# EAGLE design assistant (EAGLE 9.6.2)
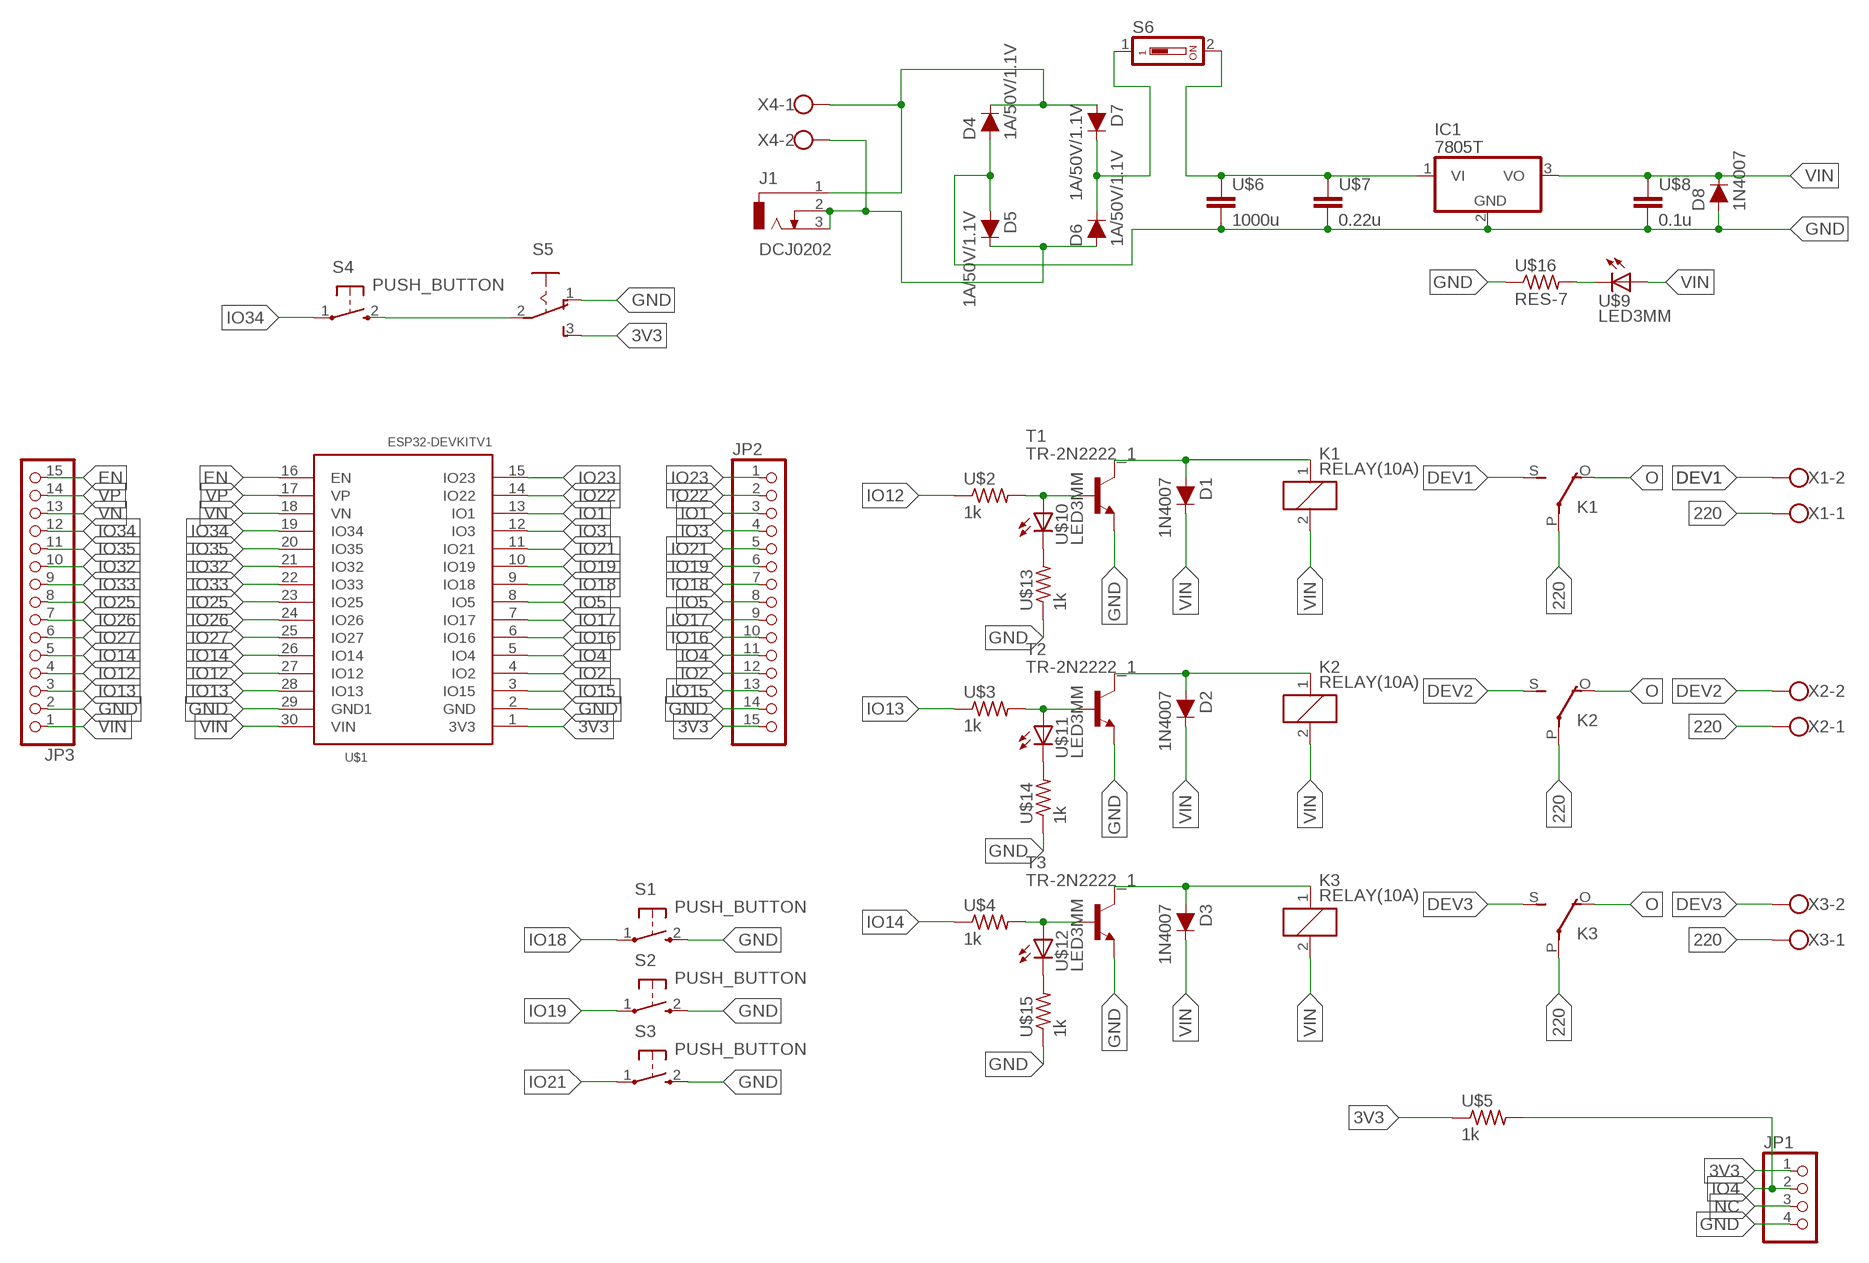
[diagram p0: schematic, sheet 1]

## Parts
D1  1N4007  DIODE(1A)-PTH  [DIODE-1N4001]
D2  1N4007  DIODE(1A)-PTH  [DIODE-1N4001]
D3  1N4007  DIODE(1A)-PTH  [DIODE-1N4001]
D4  1A/50V/1.1V  DIODE(1A)-PTH  [DIODE-1N4001]
D5  1A/50V/1.1V  DIODE(1A)-PTH  [DIODE-1N4001]
D6  1A/50V/1.1V  DIODE(1A)-PTH  [DIODE-1N4001]
D7  1A/50V/1.1V  DIODE(1A)-PTH  [DIODE-1N4001]
D8  1N4007  DIODE(1A)-PTH  [DIODE-1N4001]
IC1  7805T  [TO220H]
J1  DCJ0202  [DCJ0202]
JP1  PINHD-1X4  [1X04]
JP2  PINHD-1X15  [1X15]
JP3  PINHD-1X15  [1X15]
K1  RELAY(10A)  [G5LE]
K2  RELAY(10A)  [G5LE]
K3  RELAY(10A)  [G5LE]
S1  PUSH_BUTTON  [B3F-10XX]
S2  PUSH_BUTTON  [B3F-10XX]
S3  PUSH_BUTTON  [B3F-10XX]
S4  PUSH_BUTTON  [B3F-10XX]
S5  SLIDING_SWITCH  [255SB]
S6  DS01  [DS-01]
T1  TR-2N2222_1  [TO92-EBC]
T2  TR-2N2222_1  [TO92-EBC]
T3  TR-2N2222_1  [TO92-EBC]
U$1  ESP32DEVKITV1  [ESP32-DEVKITV1]
U$2  1k  RES-7  [0204/7]
U$3  1k  RES-7  [0204/7]
U$4  1k  RES-7  [0204/7]
U$5  1k  RES-7  [0204/7]
U$6  1000u  CAPACITOR  [C025-025X050]
U$7  0.22u  CAPACITOR  [C025-025X050]
U$8  0.1u  CAPACITOR  [C025-025X050]
U$9  LED3MM  [LED3MM]
U$10  LED3MM  [LED3MM]
U$11  LED3MM  [LED3MM]
U$12  LED3MM  [LED3MM]
U$13  1k  RES-7  [0204/7]
U$14  1k  RES-7  [0204/7]
U$15  1k  RES-7  [0204/7]
U$16  RES-7  [0204/7]
X1  ROSTA.POWER  [W239-302]
X2  ROSTA.POWER  [W239-302]
X3  ROSTA.POWER  [W239-302]
X4  ROSTA.POWER  [W239-302]

## Nets
3V3: JP1.1 JP2.15 S5.3(S) U$1.1(3V3) U$5.1
220: K1.P(2:P) K2.P(2:P) K3.P(2:P) X1.1 X2.1 X3.1
DEV1: K1.S(2:S) X1.2
DEV2: K2.S(2:S) X2.2
DEV3: K3.S(2:S) X3.2
EN: JP3.15 U$1.16(EN)
GND: D4.A D5.A D8.A IC1.2(GND) JP1.4 JP2.14 JP3.2 S1.2(S) S2.2(S) S3.2(S) S5.1(O) T1.E T2.E T3.E U$1.2(GND) U$1.29(GND1) U$6.2 U$7.2 U$8.2 U$13.1 U$14.1 U$15.1 U$16.1
IO1: JP2.3 U$1.13(IO1)
IO2: JP2.12 U$1.4(IO2)
IO3: JP2.4 U$1.12(IO3)
IO4: JP1.2 JP2.11 U$1.5(IO4) U$5.2
IO5: JP2.8 U$1.8(IO5)
IO12: JP3.4 U$1.27(IO12) U$2.1
IO13: JP3.3 U$1.28(IO13) U$3.1
IO14: JP3.5 U$1.26(IO14) U$4.1
IO15: JP2.13 U$1.3(IO15)
IO16: JP2.10 U$1.6(IO16)
IO17: JP2.9 U$1.7(IO17)
IO18: JP2.7 S1.1(P) U$1.9(IO18)
IO19: JP2.6 S2.1(P) U$1.10(IO19)
IO21: JP2.5 S3.1(P) U$1.11(IO21)
IO22: JP2.2 U$1.14(IO22)
IO23: JP2.1 U$1.15(IO23)
IO25: JP3.8 U$1.23(IO25)
IO26: JP3.7 U$1.24(IO26)
IO27: JP3.6 U$1.25(IO27)
IO32: JP3.10 U$1.21(IO32)
IO33: JP3.9 U$1.22(IO33)
IO34: JP3.12 S4.1(P) U$1.19(IO34)
IO35: JP3.11 U$1.20(IO35)
N$1: T1.B U$2.2 U$10.A
N$2: D1.A K1.1 T1.C
N$3: T2.B U$3.2 U$11.A
N$4: D2.A K2.1 T2.C
N$5: T3.B U$4.2 U$12.A
N$6: D3.A K3.1 T3.C
N$7: D5.C D6.A J1.2 J1.3 X4.2
N$8: S4.2(S) S5.2(P)
N$9: D4.C D7.A J1.1 X4.1
N$11: U$10.K(C) U$13.2
N$12: U$11.K(C) U$14.2
N$13: IC1.1(VI) S6.2 U$6.1 U$7.1
N$14: U$12.K(C) U$15.2
N$15: U$9.K(C) U$16.2
N$16: D6.C D7.C S6.1
NC: JP1.3
O: K1.O(2:O) K2.O(2:O) K3.O(2:O)
VIN: D1.C D2.C D3.C D8.C IC1.3(VO) JP3.1 K1.2 K2.2 K3.2 U$1.30(VIN) U$8.1 U$9.A
VN: JP3.13 U$1.18(VN)
VP: JP3.14 U$1.17(VP)

## Library data of the parts
D1-D3 D8 = MIA_LIBRARY-2-2-2:DIODE(1A): Diode These are standard reverse protection diodes and small signal diodes. SparkFun Products: SparkFun SparkPunk Sound Kit <https://www.sparkfun.com/products/11177> SparkFun ESP8266 Thing <https://www.sparkfun.com/products/13231>; PROD_ID: DIO-09176; VALUE: 1A/50V/1.1V
D4-D7 = MIA_LIBRARY-2-2-2:DIODE(1A): Diode These are standard reverse protection diodes and small signal diodes. SparkFun Products: SparkFun SparkPunk Sound Kit <https://www.sparkfun.com/products/11177> SparkFun ESP8266 Thing <https://www.sparkfun.com/products/13231>; PROD_ID: DIO-09176
IC1 = adafruit:78*: Positive VOLTAGE REGULATOR Added bigger pads to the TO-92 package
J1 = con-jack:DCJ0202: DC POWER JACK Source: DCJ0202.pdf; OC_FARNELL: unknown; OC_NEWARK: unknown
JP1 = MIA_LIBRARY-2-2-2:PINHD-1X4: PIN HEADER
JP2 JP3 = MIA_LIBRARY-2-2-2:PINHD-1X15: PIN HEADER
K1-K3 = MIA_LIBRARY-2-2-2:RELAY(10A): RELAY 1 x switch, 10 A/120 V AC, 8 A/30 V ADC, Omron; OC_FARNELL: unknown; OC_NEWARK: unknown
S1-S4 = MIA_LIBRARY-2-2-2:PUSH_BUTTON: OMRON SWITCH
S5 = MIA_LIBRARY-2-2-2:SLIDING_SWITCH: SLIDING SWITCH Distributor Buerklin, 11G810
S6 = MIA_LIBRARY-2-2-2:DS01: DIL/CODE SWITCH; OC_FARNELL: unknown; OC_NEWARK: unknown
T1-T3 = MIA_LIBRARY-2-2-2:TR-2N2222_1: NPN TRANSISTOR
U$1 = MIA_LIBRARY-2-2-2:ESP32DEVKITV1
U$2-U$5 U$13-U$16 = MIA_LIBRARY-2-2-2:RES-7
U$6-U$8 = MIA_LIBRARY-2-2-2:CAPACITOR
U$9-U$12 = MIA_LIBRARY-2-2-2:LED3MM
X1-X4 = MIA_LIBRARY-2-2-2:ROSTA.POWER: WAGO SCREW CLAMP; OC_FARNELL: unknown; OC_NEWARK: unknown

## Board
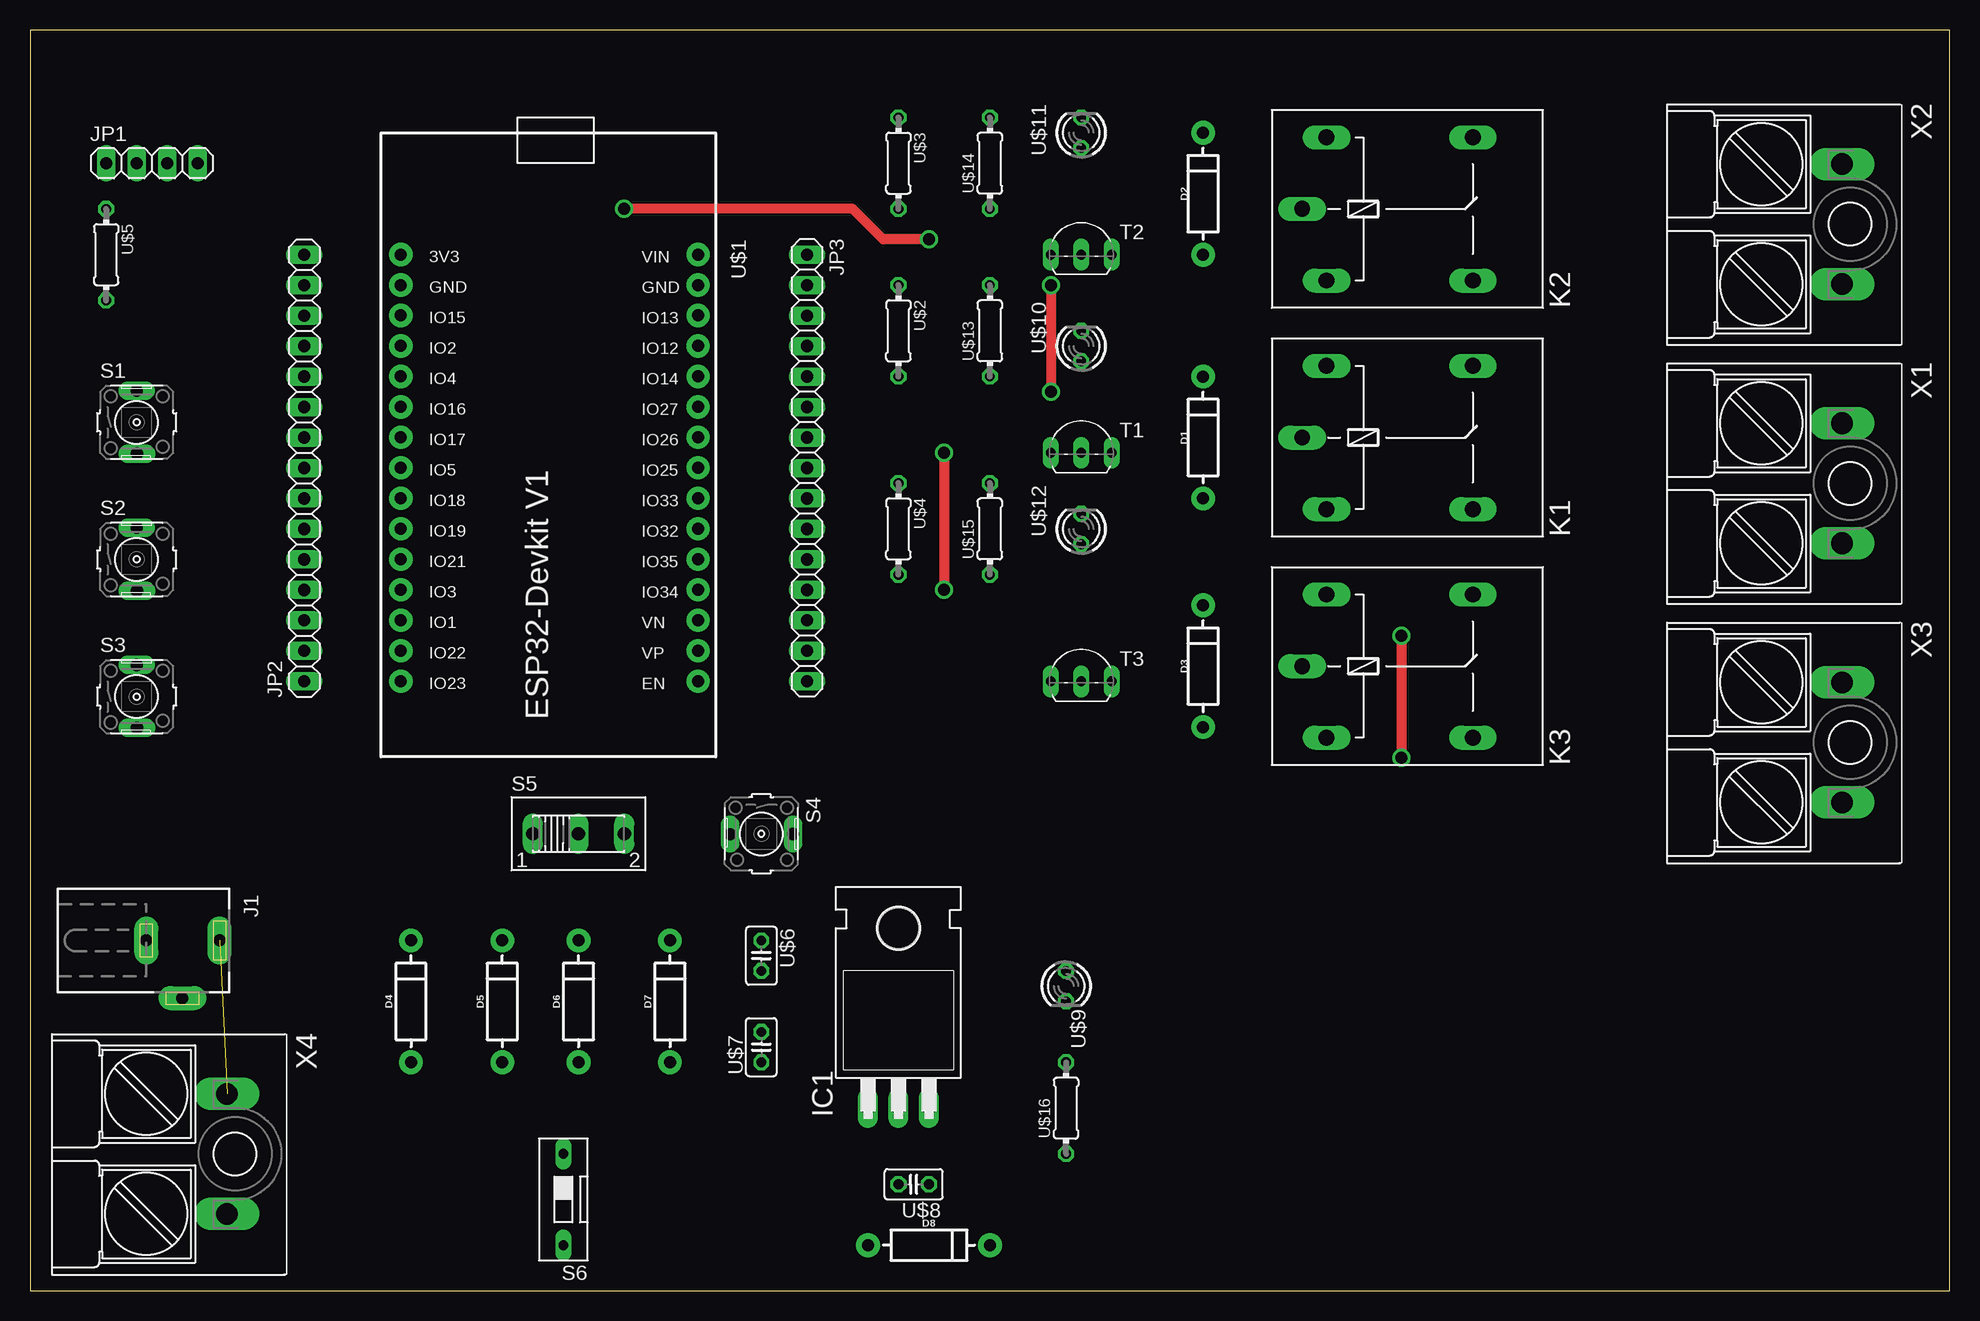
[diagram p1: board, top side]
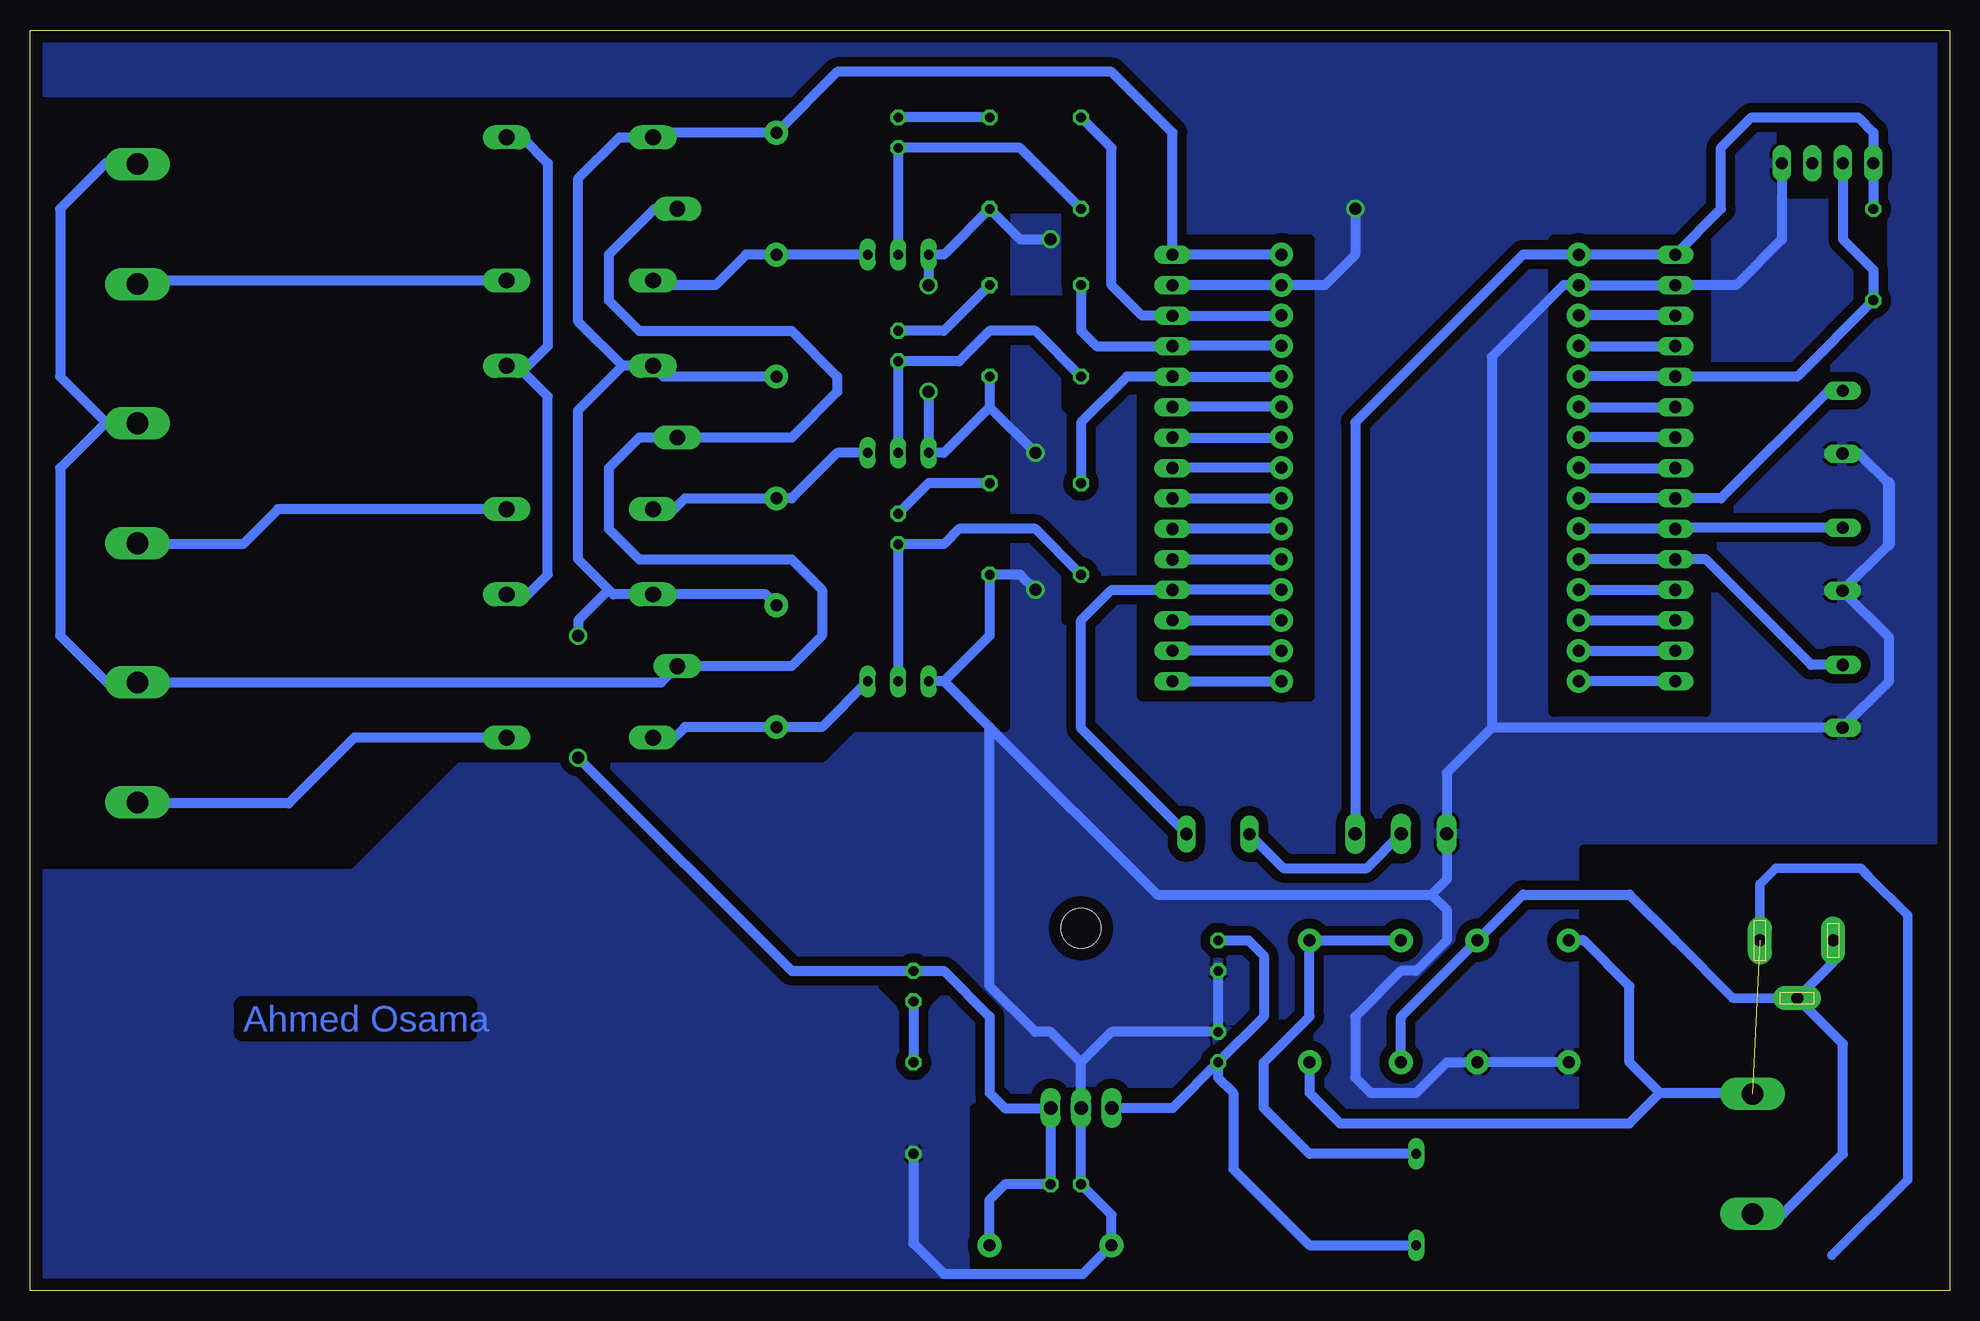
[diagram p2: board, bottom side, seen from below]

Size 160 x 105.08 mm. Coordinates in mm from the lower left corner, seen from the top.
Outline: 0,0 160,0 160,105.08 0,105.08 0,0
Copper layers (1*16): Top 0.035mm / dielectric 1.5mm / Bottom 0.035mm
Design rules "default *": minimum track width 0.8mm, minimum drill 0.35mm, track to track 0.8mm, track to pad 0.5mm, pad to pad 6mil, via to via 6mil, smd to smd 6mil, copper to edge 40mil, drill to drill 6mil, minimum pad ring 10mil, minimum via ring 8mil, stop-mask expansion 4mil, vias tented up to drill 0mil, thermal gap 10mil

### Footprints (pad centres in the part's own frame; a part is rotated, then mirrored left to right if it is on the bottom)
DIODE-1N4001 = drill 1 pad 1.981: A -5.08,0; C 5.08,0
TO220H = drill 1.118 long: 1 -2.54,-10.16; 2 0,-10.16; 3 2.54,-10.16 | hole 3.302: 0,4.826
DCJ0202 = drill 1 pad 2 long: 1 0,3.1; 2 4.8,0; 3 0,-3
1X04 = drill 1.016 long: 1 -3.81,0; 2 -1.27,0; 3 1.27,0; 4 3.81,0
1X15 = drill 1.016 long: 1 -17.78,0; 2 -15.24,0; 3 -12.7,0; 4 -10.16,0; 5 -7.62,0; 6 -5.08,0; 7 -2.54,0; 8 0,0; 9 2.54,0; 10 5.08,0; 11 7.62,0; 12 10.16,0; 13 12.7,0; 14 15.24,0; 15 17.78,0
G5LE = drill 1.321 long: 1 -7.493,-5.969; 2 -7.493,5.969; O 4.699,5.969; P -9.525,0; S 4.699,-5.969
B3F-10XX = drill 1.016 long: 1 0.013,2.636; 2 0.029,-2.605
255SB = drill 1.118 long: 1 -3.81,0; 2 0,0; 3 3.81,0
DS-01 = drill 0.813 long: 1 0,-3.81; 2 0,3.81
TO92-EBC = drill 0.813 long: B 0,-1.27; C 2.54,-1.27; E -2.54,-1.27
ESP32-DEVKITV1 = drill 1 pad 1.93: 1 -22.87,-13.54; 2 -20.33,-13.54; 3 -17.79,-13.54; 4 -15.25,-13.54; 5 -12.71,-13.54; 6 -10.17,-13.54; 7 -7.63,-13.54; 8 -5.09,-13.54; 9 -2.55,-13.54; 10 -0.01,-13.54; 11 2.53,-13.54; 12 5.07,-13.54; 13 7.61,-13.54; 14 10.15,-13.54; 15 12.69,-13.54; 16 12.69,11.23; 17 10.15,11.23; 18 7.61,11.23; 19 5.07,11.23; 20 2.53,11.23; 21 -0.01,11.23; 22 -2.55,11.23; 23 -5.09,11.23; 24 -7.63,11.23; 25 -10.17,11.23; 26 -12.71,11.23; 27 -15.25,11.23; 28 -17.79,11.23; 29 -20.33,11.23; 30 -22.87,11.23
0204/7 = drill 0.813 octagon: 1 -3.81,0; 2 3.81,0
C025-025X050 = drill 0.813 octagon: 1 -1.27,0; 2 1.27,0
LED3MM = drill 0.813 octagon: A -1.27,0; K 1.27,0
W239-302 = drill 1.8 long: 1 -5,5; 2 5,5

### Placement (x,y rotation side)
D1  97.79,71.12 90 top
D2  97.79,91.44 90 top
D3  97.79,52.07 90 top
D4  31.75,24.13 90 top
D5  39.37,24.13 90 top
D6  45.72,24.13 90 top
D7  53.34,24.13 90 top
D8  74.93,3.81 0 top
IC1  72.39,25.4 0 top
J1  12.7,29.21 270 top
JP1  10.16,93.98 0 top
JP2  22.86,68.58 90 top
JP3  64.77,68.58 270 top
K1  115.57,71.12 0 top
K2  115.57,90.17 0 top
K3  115.57,52.07 0 top
S1  8.89,72.39 0 top
S2  8.89,60.96 0 top
S3  8.89,49.53 0 top
S4  60.96,38.1 270 top
S5  45.72,38.1 0 top
S6  44.45,7.62 180 top
T1  87.63,71.12 0 top
T2  87.63,87.63 0 top
T3  87.63,52.07 0 top
U$1  44.45,63.5 270 top
U$2  72.39,80.01 270 top
U$3  72.39,93.98 270 top
U$4  72.39,63.5 270 top
U$5  6.35,86.36 270 top
U$6  60.96,27.94 270 top
U$7  60.96,20.32 90 top
U$8  73.66,8.89 180 top
U$9  86.36,25.4 270 top
U$10  87.63,78.74 90 top
U$11  87.63,96.52 90 top
U$12  87.63,63.5 90 top
U$13  80.01,80.01 90 top
U$14  80.01,93.98 90 top
U$15  80.01,63.5 90 top
U$16  86.36,15.24 90 top
X1  146.05,67.31 270 top
X2  146.05,88.9 270 top
X3  146.05,45.72 270 top
X4  11.43,11.43 270 top

### Tracks (layer width: path | path; a pad name or v marks a point on that pad's centre or on a via)
3V3
  Bottom 0.813: U$5.1 JP1.1 6.35,96.52 7.62,97.79 16.51,97.79 19.05,95.25 19.05,90.17 JP2.15 U$1.1 35.56,86.36 49.53,72.39 S5.3
220
  Bottom 0.813: X2.1 151.13,93.98 153.67,93.98 157.48,90.17 157.48,76.2 153.67,72.39 151.13,72.39 X1.1 153.75,72.31 157.48,68.58 157.48,54.61 153.59,50.72 X3.1 107.39,50.72 K3.P 96.52,52.07 93.98,54.61 93.98,58.42 96.52,60.96 109.22,60.96 111.76,63.5 111.76,68.58 109.22,71.12 K1.P 96.52,71.12 92.71,74.93 92.71,76.2 96.52,80.01 109.22,80.01 111.76,82.55 111.76,86.36 107.95,90.17 K2.P
DEV1
  Bottom 0.813: K1.S 139.32,65.15 142.24,62.23 150.97,62.23 X1.2
DEV2
  Bottom 0.813: K2.S 150.75,84.2 X2.2
DEV3
  Bottom 0.813: K3.S 132.97,46.1 138.43,40.64 150.97,40.64 X3.2
EN
  Bottom 0.813: JP3.15 U$1.16
GND  (via drill 1)
  Top 0.813: v74.93,87.63 71.12,87.63 68.58,90.17 v49.53,90.17 | v85.09,83.82 v85.09,74.93 | v76.2,69.85 v76.2,58.42
  Bottom 0.813: JP3.2 U$1.29 52.06,83.83 49.53,86.36 v49.53,90.17 | JP1.4 13.97,87.63 17.78,83.82 JP2.14 U$1.2 32.18,83.83 38.16,77.84 38.16,46.92 | S1.2 7.55,69.78 5.08,67.31 | 5.08,62.19 S2.2 5.08,54.52 5.08,50.76 S3.2 38.16,46.92 | U$13.1 80.01,73.66 | 80.01,73.66 83.82,69.85 T1.E v85.09,74.93 | 83.82,50.8 80.01,54.61 U$15.1 77.47,59.69 v76.2,58.42 | 83.82,50.8 T3.E | U$16.1 86.36,3.96 83.82,1.42 72.24,1.42 D8.A 69.85,6.35 U$8.2 IC1.2 72.39,19.05 | 72.39,19.05 69.85,21.59 U$7.2 U$6.2 | D4.A D5.A 41.91,19.05 44.45,16.51 48.26,16.51 49.53,17.78 49.53,22.86 45.72,26.67 44.45,26.67 41.91,29.21 41.91,31.75 43.18,33.02 | 43.18,33.02 41.91,34.29 S5.1 41.91,43.18 38.16,46.92 | 72.39,19.05 74.93,21.59 76.2,21.59 80.01,25.4 80.01,46.99 | 80.01,46.99 83.82,50.8 | 80.01,46.99 66.04,33.02 43.18,33.02 | v74.93,87.63 77.47,87.63 U$14.1 83.82,86.36 T2.E v85.09,83.82 | 80.01,73.66 v76.2,69.85
  Bottom 1.016: 5.08,67.31 5.08,62.19
  pour Bottom: 0,0 0,104.14 0,105.41 161.29,105.41 161.29,0
  cutout Bottom: 10.16,96.52 10.16,91.44 13.97,91.44 13.97,96.52
  cutout Bottom: 20.32,87.63 20.32,48.26 33.02,48.26 33.02,87.63
  cutout Bottom: 53.34,87.63 53.34,49.53 67.31,49.53 67.31,87.63
  cutout Bottom: 78.74,99.06 78.74,46.99 91.44,46.99 93.98,44.45 124.46,44.45 133.35,35.56 158.75,35.56 158.75,99.06
  cutout Bottom: 0,36.83 30.48,36.83 30.48,1.27 0,1.27
  cutout Bottom: 30.48,12.7 54.61,12.7 57.15,15.24 60.96,15.24 60.96,16.51 71.12,16.51 71.12,0 30.48,0
  cutout Bottom: 71.12,13.97 78.74,13.97 80.01,12.7 80.01,1.27 71.12,1.27
  cutout Bottom: 81.28,15.24 81.28,1.27 80.01,1.27 78.74,2.54 78.74,13.97 80.01,15.24
  cutout Bottom: 5.59,90.17 5.59,82.55 7.62,82.55 7.62,90.17
  cutout Bottom: 71.12,76.2 71.12,73.66 72.39,72.39 73.66,73.66 73.66,76.2
  cutout Bottom: 71.12,90.17 73.66,90.17 73.66,83.82 71.12,83.82
  cutout Bottom: 73.66,90.17 78.74,90.17 78.74,93.98 77.47,93.98
  cutout Bottom: 78.74,82.55 73.66,82.55 73.66,80.01 74.93,81.28 78.74,81.28
  cutout Bottom: 73.66,55.88 73.66,59.69 71.12,59.69 71.12,55.88
  cutout Bottom: 88.9,26.67 88.9,25.4 87.63,24.13 85.09,24.13 83.82,25.4 83.82,26.67
IO1
  Bottom 0.813: U$1.13 JP2.3
IO2
  Bottom 0.813: U$1.4 JP2.12
IO3
  Bottom 0.813: U$1.12 JP2.4
IO4
  Bottom 0.813: U$1.5 JP2.11 12.7,76.2 U$5.2 6.35,85.09 8.89,87.63 JP1.2
IO5
  Bottom 0.813: U$1.8 JP2.8
IO12
  Bottom 0.813: U$1.27 JP3.4 71.12,78.74 72.39,80.01 U$2.1
IO13
  Bottom 0.813: U$1.28 JP3.3 67.31,81.28 69.85,83.82 69.85,95.25 U$3.1
IO14
  Bottom 0.813: U$1.26 JP3.5 68.58,76.2 72.39,72.39 U$4.1
IO15
  Bottom 0.813: JP2.13 U$1.3
IO16
  Bottom 0.813: U$1.6 JP2.10
IO17
  Bottom 0.813: JP2.9 U$1.7
IO18
  Bottom 0.813: U$1.9 JP2.7 19.05,66.04 10.06,75.03 S1.1
IO19
  Bottom 0.813: JP2.6 | JP2.6 U$1.10 | S2.1 22.78,63.6 JP2.6
IO21
  Bottom 0.813: JP2.5 | JP2.5 U$1.11 | S3.1 11.53,52.17 20.33,60.97 JP2.5
IO22
  Bottom 0.813: U$1.14 JP2.2
IO23
  Bottom 0.813: JP2.1 U$1.15
IO25
  Bottom 0.813: U$1.23 JP3.8
IO26
  Bottom 0.813: JP3.7 U$1.24
IO27
  Bottom 0.813: U$1.25 JP3.6
IO32
  Bottom 0.813: U$1.21 JP3.10
IO33
  Bottom 0.813: JP3.9 U$1.22
IO34
  Bottom 0.813: U$1.19 JP3.12 | JP3.12 | S4.1 72.39,46.88 72.39,55.88 69.84,58.43 JP3.12
IO35
  Bottom 0.813: JP3.11 U$1.20
N$1
  Bottom 0.813: U$2.2 76.2,80.01 80.01,80.01 82.55,77.47 U$10.A T1.B
N$2
  Bottom 0.813: T1.C 92.71,69.85 96.52,66.04 D1.A 105.41,66.04 106.3,65.15 K1.1
N$3
  Bottom 0.813: T2.B U$11.A 77.47,95.25 U$3.2
N$4
  Bottom 0.813: T2.C D2.A 100.33,86.36 102.87,83.82 107.7,83.82 K2.1
N$5
  Bottom 0.813: U$4.2 76.2,63.5 82.55,63.5 83.82,62.23 U$12.A T3.B
N$6
  Bottom 0.813: T3.C 93.98,46.99 D3.A 105.41,46.99 106.68,45.72 107.7,45.72 K3.1
N$7
  Bottom 0.8: 22.86,29.21 18.06,24.41 J1.2
  Bottom 0.813: X4.2 13.89,6.43 8.89,11.43 8.89,20.6 J1.2 9.7,27.41 J1.3 | D6.A 45.72,22.86 D5.C 35.56,33.02 26.67,33.02 22.86,29.21
N$8
  Bottom 0.813: S4.2 55.53,35.25 48.57,35.25 S5.2
N$9  (1 unrouted)
  Bottom 0.8: J1.1 15.8,33.9 14.5,35.21 7.38,35.21 6.71,34.53 3.49,31.31 3.49,10.48 3.49,9.27 9.8,2.96
  Bottom 0.813: D7.A 53.34,16.51 50.8,13.97 26.67,13.97 24.13,16.51 | 24.13,16.51 16.51,16.51 X4.1 | 24.13,16.51 26.67,19.05 26.67,25.4 30.48,29.21 D4.C
N$11
  Bottom 0.813: U$13.2 83.82,80.01 U$10.K
N$12
  Bottom 0.813: U$14.2 U$11.K
N$13
  Bottom 0.813: U$7.1 64.77,15.24 IC1.1 | U$6.1 58.42,29.21 57.15,27.94 57.15,22.86 U$7.1 | U$7.1 60.96,17.78 59.69,16.51 59.69,10.16 53.34,3.81 S6.2
N$14
  Bottom 0.813: U$15.2 85.09,67.31 U$12.K
N$15
  Bottom 0.813: U$9.K U$16.2
N$16
  Bottom 0.813: D6.C D7.C 53.34,22.86 57.15,19.05 57.15,15.24 53.34,11.43 S6.1
O
  Bottom 0.813: K2.O 119,96.14 116.84,93.98 116.84,78.74 118.49,77.09 119.38,77.09 | K1.O 119.38,77.09 | K3.O 118.49,58.04 116.84,59.69 116.84,74.55 119.38,77.09
VIN  (via drill 1)
  Top 0.813: v114.3,54.61 v114.3,44.45
  Bottom 0.813: U$1.30 JP3.1 64.77,96.52 69.85,101.6 92.71,101.6 D2.C 107.7,96.52 K2.2 110.87,96.14 114.3,92.71 114.3,80.77 110.62,77.09 | 110.62,77.09 K1.2 107.19,76.2 D1.C | D3.C 98.68,58.04 K3.2 111.38,58.04 111.76,58.42 | D8.C 80.01,7.62 78.74,8.89 U$8.1 IC1.3 78.74,15.24 80.01,16.51 80.01,22.86 83.82,26.67 U$9.A 96.52,26.67 v114.3,44.45 | 110.62,77.09 114.3,73.41 114.3,60.96 111.76,58.42 | 111.76,58.42 114.3,55.88 v114.3,54.61
VN
  Bottom 0.813: JP3.13 U$1.18
VP
  Bottom 0.813: U$1.17 JP3.14

### Text on the board
Bottom: Ahmed Osama